# Altium schematic sheet 3.2寸_高清TFT_IPS_320x480.SchDoc
size A3
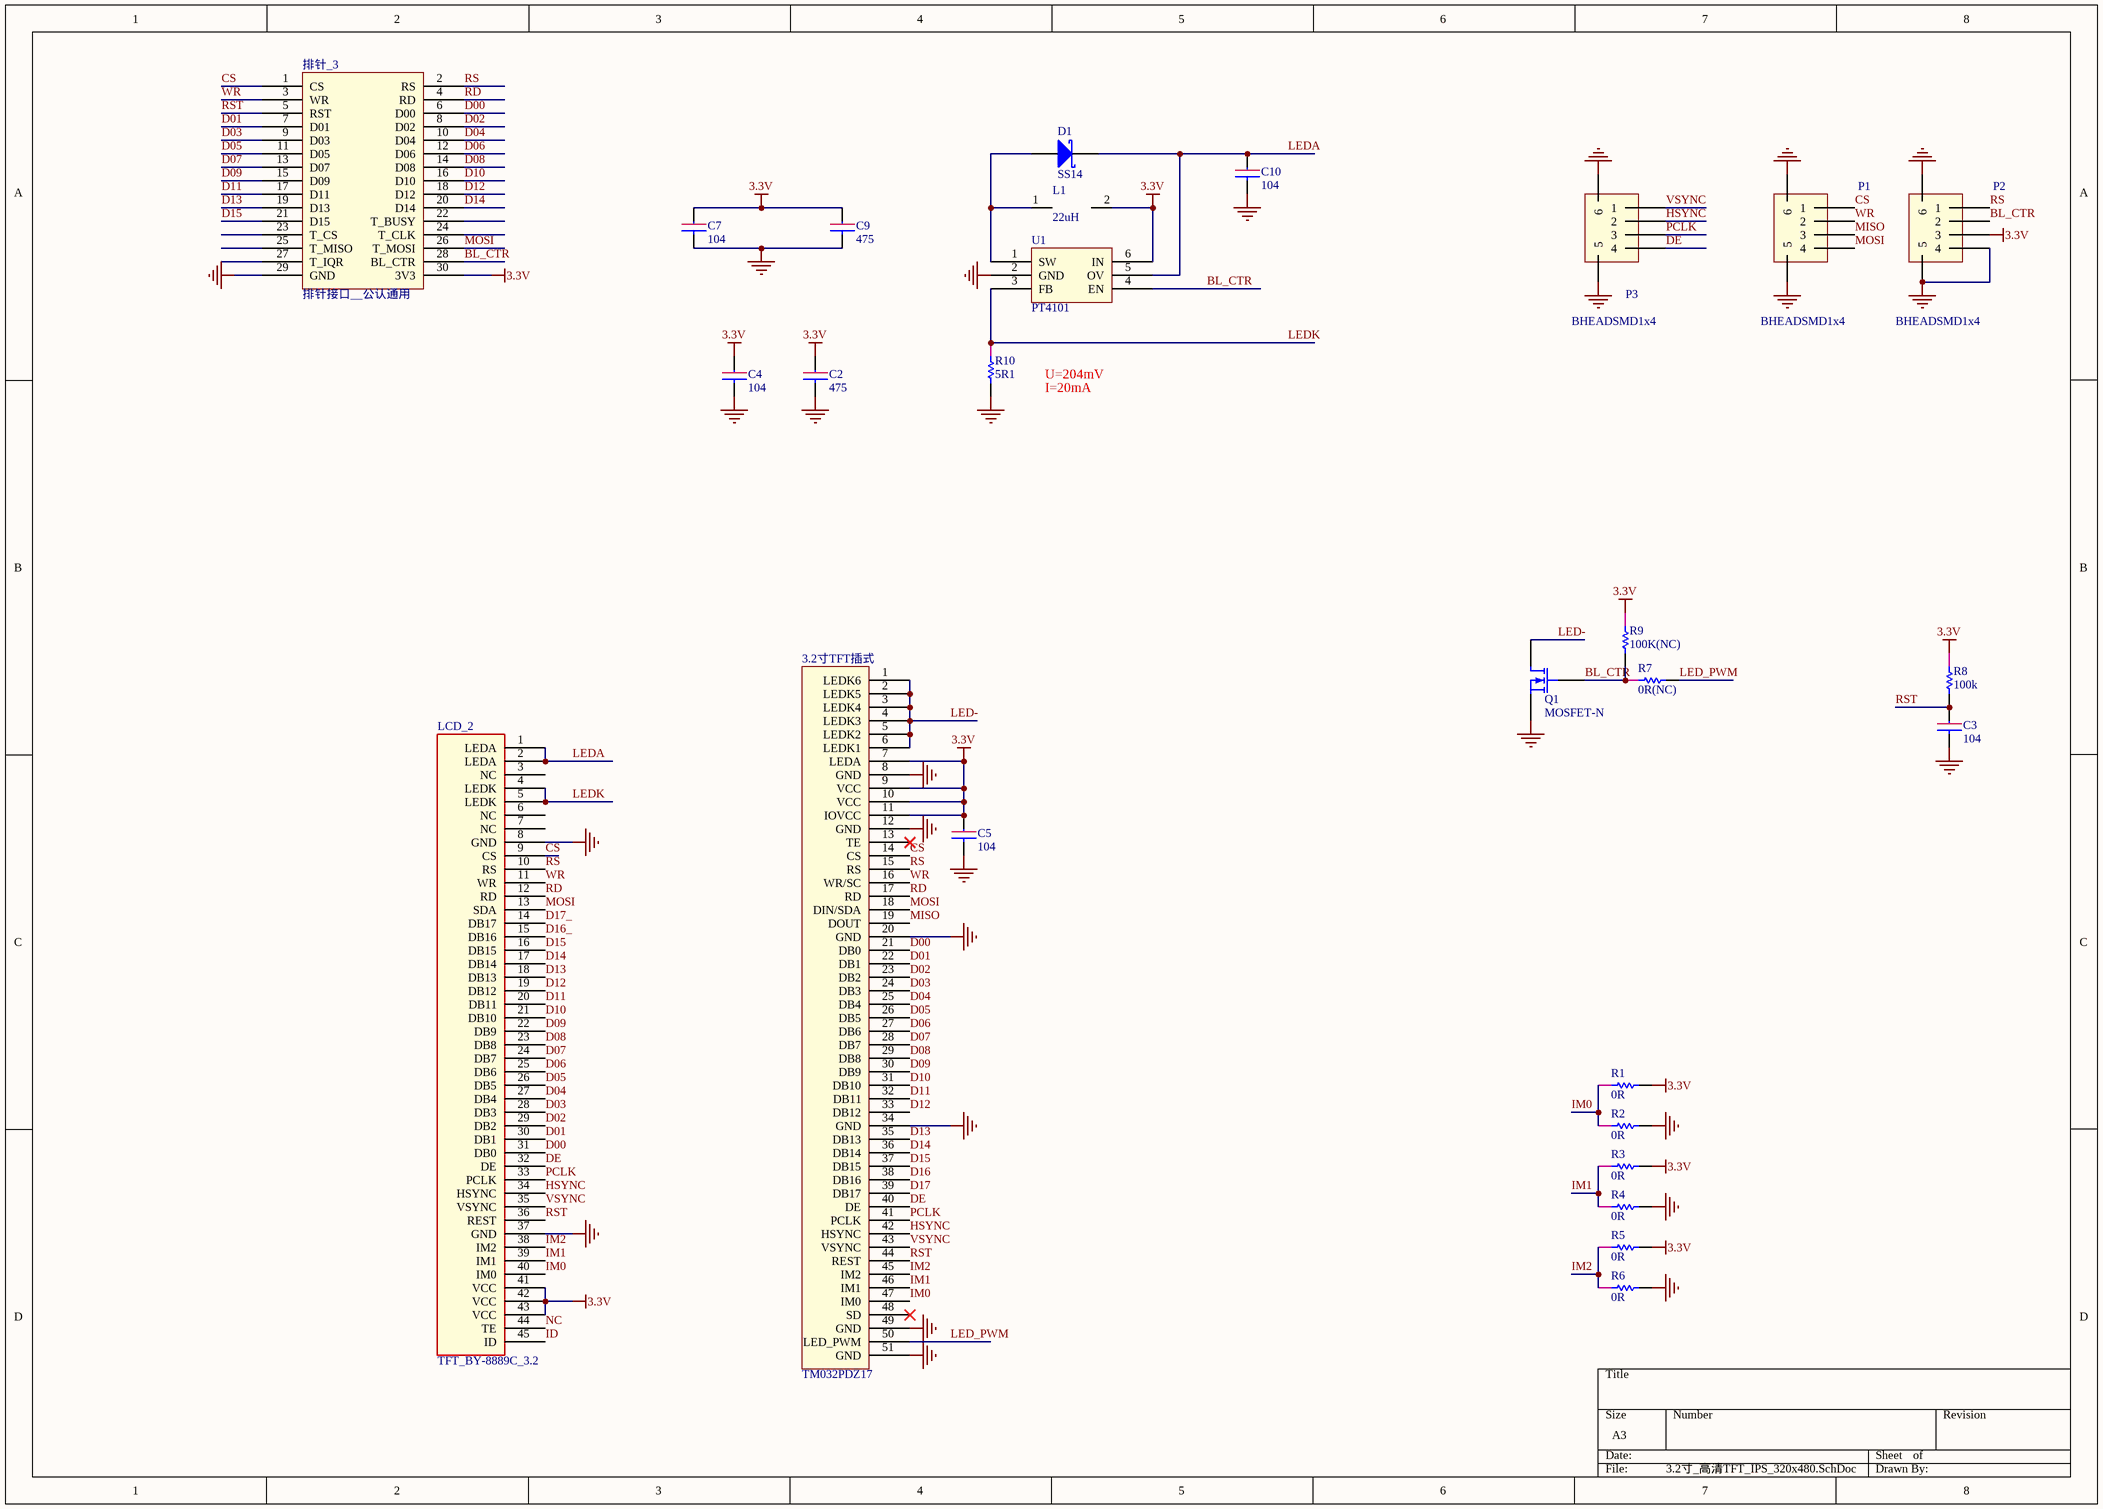
[diagram p0: 3.2寸_高清TFT_IPS_320x480.SchDoc]

## Parts
3.2寸TFT插式  TM032PDZ17  [TM032PDZ17]
C2  475  [C0603-2]
C3  104  [C0603-1]
C4  104  [C0603-1]
C5  104  [C0603-1]
C7  104  [C0603-1]
C9  475  [C0603-2]
C10  104  [C0603-2]
D1  SS14  [SOD123]
L1  22uH  [L1206]
LCD_2  TFT_BY-8889C_3.2  [TM032PDZ13]
P1  BHEADSMD1x4  [BHEADSMD1x4]
P2  BHEADSMD1x4  [BHEADSMD1x4]
P3  BHEADSMD1x4  [BHEADSMD1x4]
Q1  MOSFET-N  [SOT23A]
R1  0R  [R0603]
R2  0R  [R0603]
R3  0R  [R0603]
R4  0R  [R0603]
R5  0R  [R0603]
R6  0R  [R0603]
R7  0R(NC)  [R0603]
R8  100k  [R0603]
R9  100K(NC)  [R0603]
R10  5R1  [R0603]
U1  PT4101  [SOT23-6]
排针_3  排针接口__公认通用  [P_Head_2x15]

## Nets
3.3V: 3.2寸TFT插式.7(LEDA) 3.2寸TFT插式.9(VCC) 3.2寸TFT插式.10(VCC) 3.2寸TFT插式.11(IOVCC) C2.1 C4.1 C5.1 C7.1 C9.1 L1.2 LCD_2.41(VCC) LCD_2.42(VCC) LCD_2.43(VCC) P2.3 R1.2 R3.2 R5.2 R8.1 R9.1 U1.6(IN) 排针_3.30(3V3)
GND: 3.2寸TFT插式.8(GND) 3.2寸TFT插式.12(GND) 3.2寸TFT插式.20(GND) 3.2寸TFT插式.34(GND) 3.2寸TFT插式.49(GND) 3.2寸TFT插式.51(GND) C2.2 C3.2 C4.2 C5.2 C7.2 C9.2 C10.2 LCD_2.8(GND) LCD_2.37(GND) P1.5 P1.6 P2.4 P2.5 P2.6 P3.5 P3.6 Q1.2(S) R2.2 R4.2 R6.2 R10.2 U1.2(GND) 排针_3.29(GND)
BL_CTR: P2.2 Q1.1(G) R7.1 R9.2 U1.4(EN) 排针_3.28(BL_CTR)
CS: 3.2寸TFT插式.14(CS) LCD_2.9(CS) P1.1 排针_3.1(CS)
D00: 3.2寸TFT插式.21(DB0) LCD_2.31(DB0) 排针_3.6(D00)
D01: 3.2寸TFT插式.22(DB1) LCD_2.30(DB1) 排针_3.7(D01)
D02: 3.2寸TFT插式.23(DB2) LCD_2.29(DB2) 排针_3.8(D02)
D03: 3.2寸TFT插式.24(DB3) LCD_2.28(DB3) 排针_3.9(D03)
D04: 3.2寸TFT插式.25(DB4) LCD_2.27(DB4) 排针_3.10(D04)
D05: 3.2寸TFT插式.26(DB5) LCD_2.26(DB5) 排针_3.11(D05)
D06: 3.2寸TFT插式.27(DB6) LCD_2.25(DB6) 排针_3.12(D06)
D07: 3.2寸TFT插式.28(DB7) LCD_2.24(DB7) 排针_3.13(D07)
D08: 3.2寸TFT插式.29(DB8) LCD_2.23(DB8) 排针_3.14(D08)
D09: 3.2寸TFT插式.30(DB9) LCD_2.22(DB9) 排针_3.15(D09)
D10: 3.2寸TFT插式.31(DB10) LCD_2.21(DB10) 排针_3.16(D10)
D11: 3.2寸TFT插式.32(DB11) LCD_2.20(DB11) 排针_3.17(D11)
D12: 3.2寸TFT插式.33(DB12) LCD_2.19(DB12) 排针_3.18(D12)
D13: 3.2寸TFT插式.35(DB13) LCD_2.18(DB13) 排针_3.19(D13)
D14: 3.2寸TFT插式.36(DB14) LCD_2.17(DB14) 排针_3.20(D14)
D15: 3.2寸TFT插式.37(DB15) LCD_2.16(DB15) 排针_3.21(D15)
D16: 3.2寸TFT插式.38(DB16)
D16_: LCD_2.15(DB16)
D17: 3.2寸TFT插式.39(DB17)
D17_: LCD_2.14(DB17)
DE: 3.2寸TFT插式.40(DE) LCD_2.32(DE) P3.4
HSYNC: 3.2寸TFT插式.42(HSYNC) LCD_2.34(HSYNC) P3.2
ID: LCD_2.45(ID)
IM0: 3.2寸TFT插式.47(IM0) LCD_2.40(IM0) R1.1 R2.1
IM1: 3.2寸TFT插式.46(IM1) LCD_2.39(IM1) R3.1 R4.1
IM2: 3.2寸TFT插式.45(IM2) LCD_2.38(IM2) R5.1 R6.1
LED-: 3.2寸TFT插式.1(LEDK6) 3.2寸TFT插式.2(LEDK5) 3.2寸TFT插式.3(LEDK4) 3.2寸TFT插式.4(LEDK3) 3.2寸TFT插式.5(LEDK2) 3.2寸TFT插式.6(LEDK1) Q1.3(D)
LED_PWM: 3.2寸TFT插式.50(LED_PWM) R7.2
LEDA: C10.1 D1.2(K) LCD_2.1(LEDA) LCD_2.2(LEDA) U1.5(OV)
LEDK: LCD_2.4(LEDK) LCD_2.5(LEDK) R10.1 U1.3(FB)
MISO: 3.2寸TFT插式.19(DOUT) P1.3
MOSI: 3.2寸TFT插式.18(DIN/SDA) LCD_2.13(SDA) P1.4 排针_3.26(T_MOSI)
NC: LCD_2.44(TE)
PCLK: 3.2寸TFT插式.41(PCLK) LCD_2.33(PCLK) P3.3
RD: 3.2寸TFT插式.17(RD) LCD_2.12(RD) 排针_3.4(RD)
RS: 3.2寸TFT插式.15(RS) LCD_2.10(RS) P2.1 排针_3.2(RS)
RST: 3.2寸TFT插式.44(REST) C3.1 LCD_2.36(REST) R8.2 排针_3.5(RST)
VSYNC: 3.2寸TFT插式.43(VSYNC) LCD_2.35(VSYNC) P3.1
WR: 3.2寸TFT插式.16(WR/SC) LCD_2.11(WR) P1.2 排针_3.3(WR)
NetD1_1: D1.1(A) L1.1 U1.1(SW)

Not connected (* = marked no-connect by the designer): 3.2寸TFT插式 13(TE)* 48(SD)*; LCD_2 3(NC) 6(NC) 7(NC); 排针_3 22(T_BUSY) 23(T_CS) 24(T_CLK) 25(T_MISO) 27(T_IQR)

## Notes on the sheet
- U=204mV
- I=20mA

## Library data of the parts
C2-C5 C7 C9 C10 = cap
D1 = D Schottky: Schottky Diode; Published: 8-Jun-2000; LatestRevisionDate: 17-Jul-2002; LatestRevisionNote: Re-released for DXP Platform.; PackageReference: SMB; Publisher: Altium Limited; PackageDescription: DO-214-AA/SMB; 2 C-Bend Leads; Body 5.3 x 3.6 mm, inc. leads (LxW); Code_JEDEC: DO-214-AA
L1 = Inductor
R1-R10 = Resistor
排针_3 = LCD_common